# Altium schematic sheet UM.SchDoc: Устройство модуляции
size 594 x 420 mm
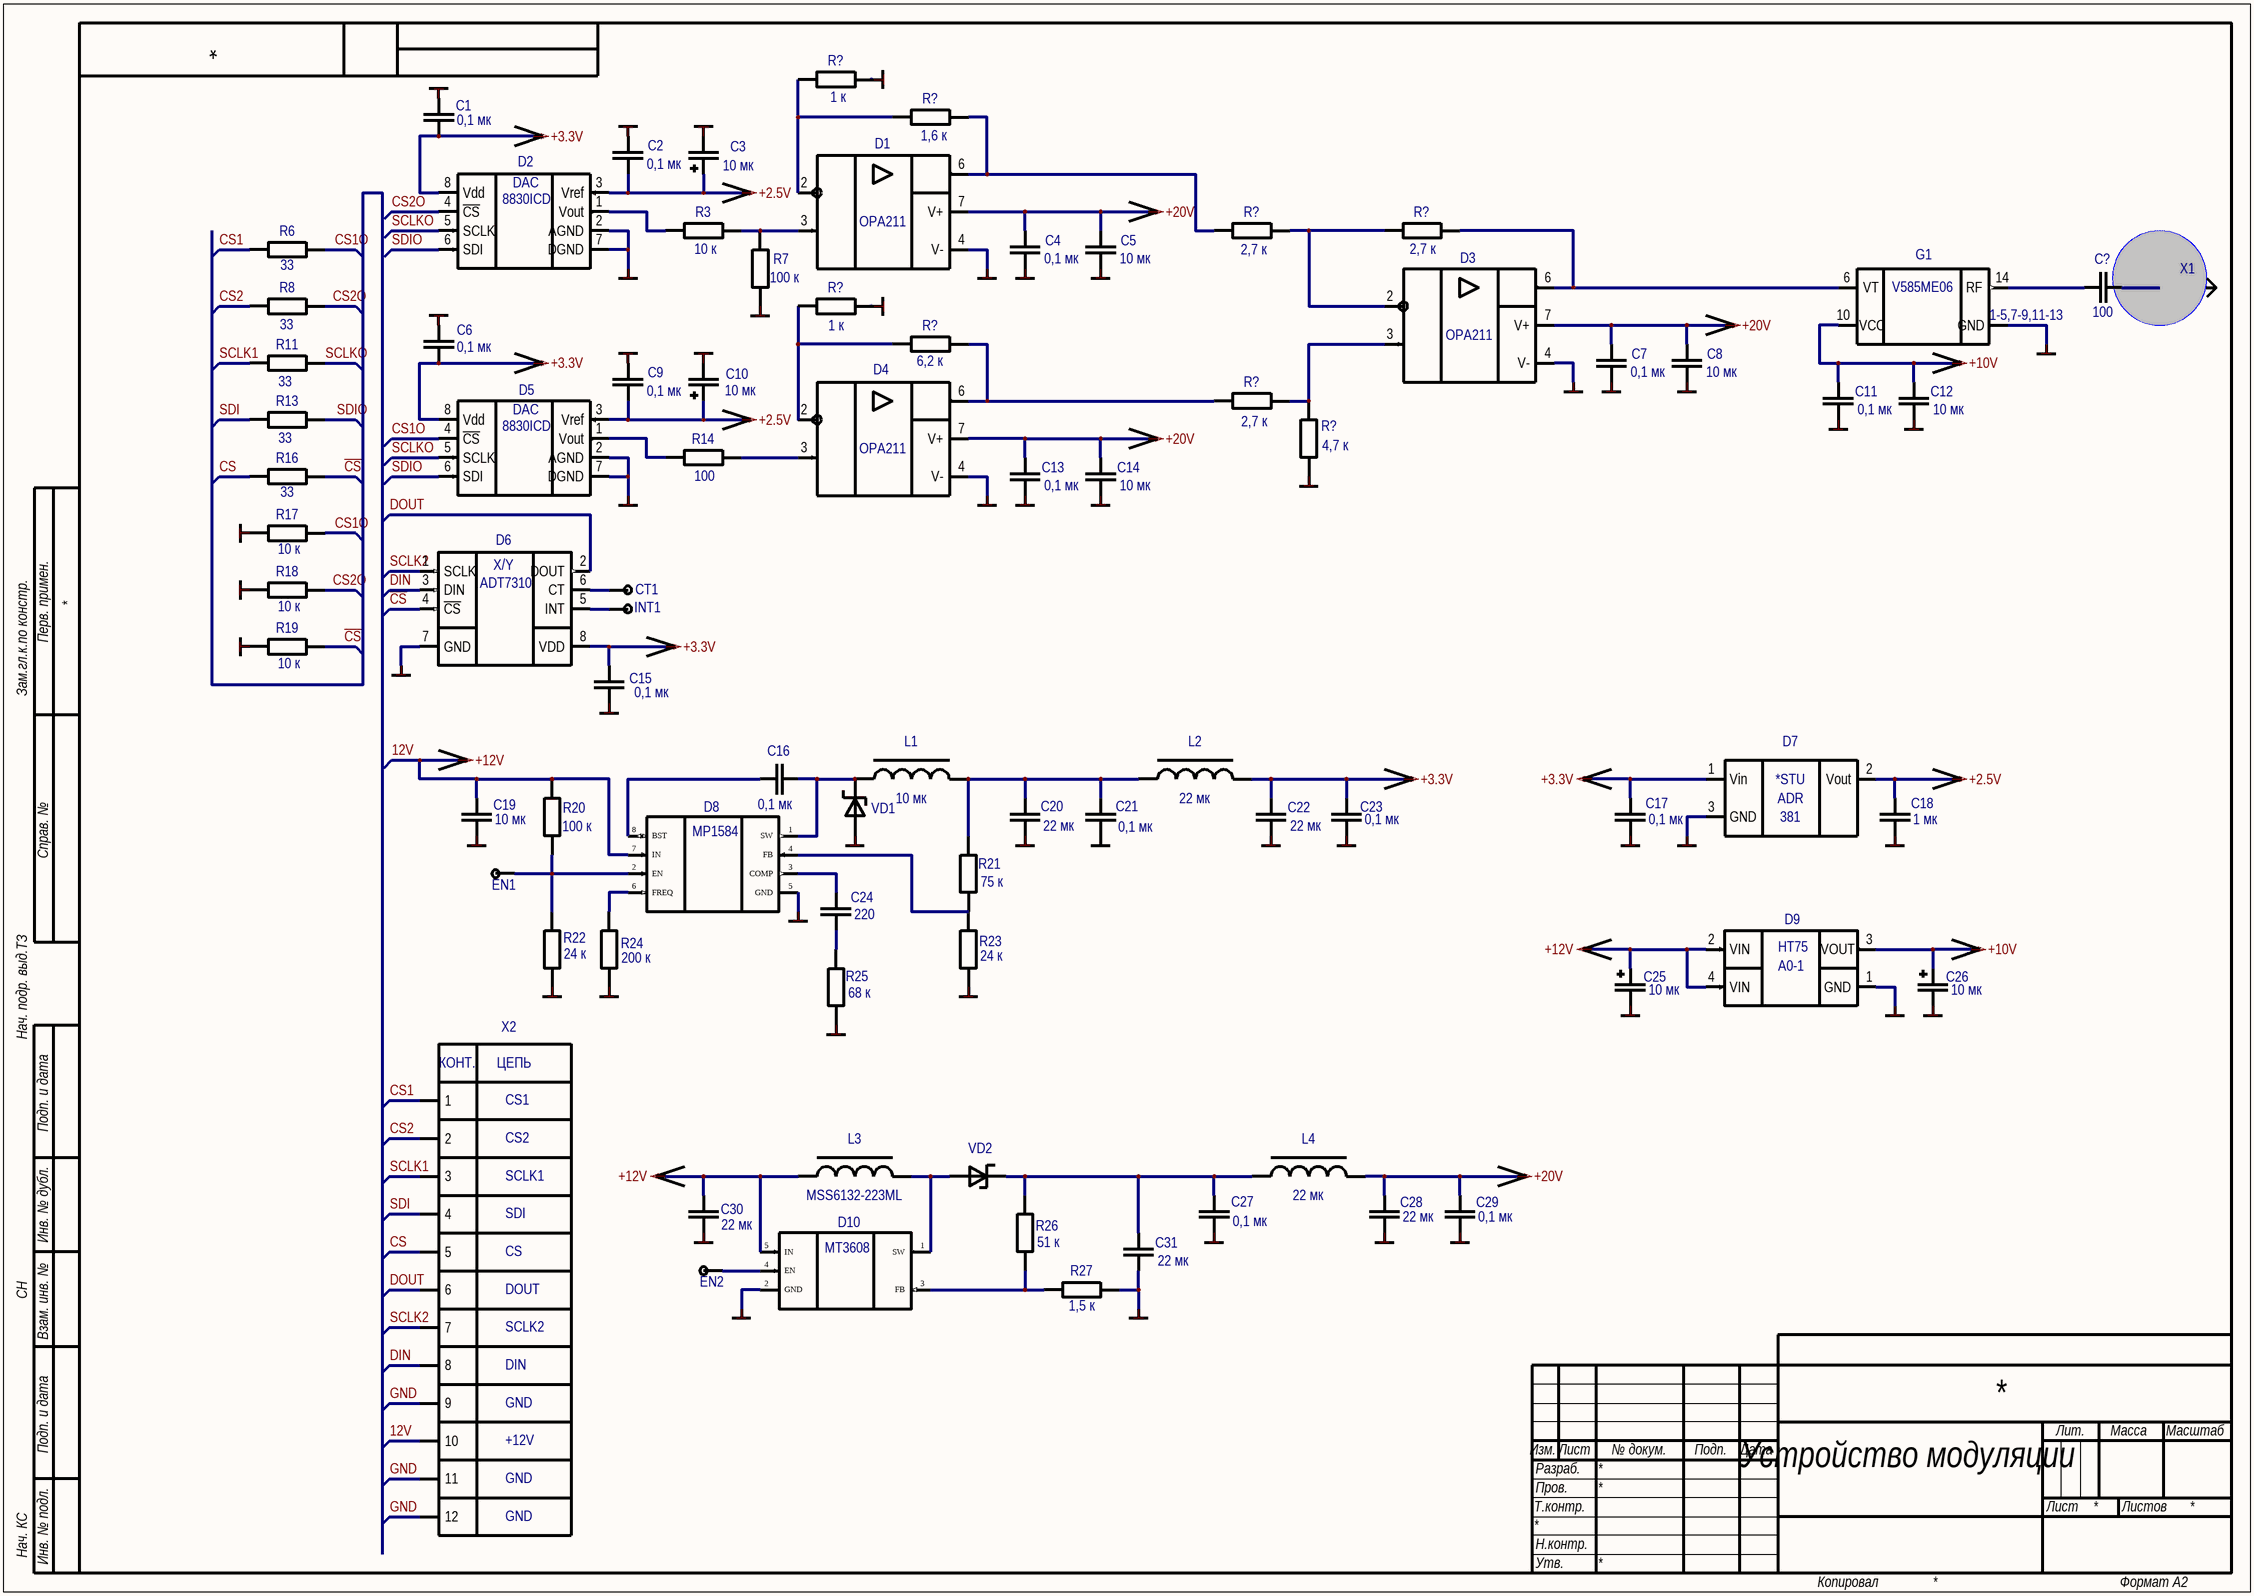
[diagram p0: UM.SchDoc]

## Parts
(Parts that share a designator on the sheet are numbered #1, #2 ... from top to bottom, then left to right.)
*?#1  GND  (value not drawn)  (graphical)
*?#2  VCC  (value not drawn)  (graphical)
*?#3  GND  (value not drawn)  (graphical)
*?#4  GND  (value not drawn)  (graphical)
*?#5  VCC  (value not drawn)  (graphical)
*?#6  VCC  (value not drawn)  (graphical)
*?#7  GND  (value not drawn)  (graphical)
*?#8  GND  (value not drawn)  (graphical)
*?#9  GND  (value not drawn)  (graphical)
*?#10  GND  (value not drawn)  (graphical)
*?#11  GND  (value not drawn)  (graphical)
*?#12  GND  (value not drawn)  (graphical)
*?#13  VCC  (value not drawn)  (graphical)
*?#14  GND  (value not drawn)  (graphical)
*?#15  VCC  (value not drawn)  (graphical)
*?#16  GND  (value not drawn)  (graphical)
*?#17  GND  (value not drawn)  (graphical)
*?#18  VCC  (value not drawn)  (graphical)
*?#19  GND  (value not drawn)  (graphical)
*?#20  GND  (value not drawn)  (graphical)
*?#21  GND  (value not drawn)  (graphical)
*?#22  VCC  (value not drawn)  (graphical)
*?#23  GND  (value not drawn)  (graphical)
*?#24  GND  (value not drawn)  (graphical)
*?#25  VCC  (value not drawn)  (graphical)
*?#26  GND  (value not drawn)  (graphical)
*?#27  GND  (value not drawn)  (graphical)
*?#28  GND  (value not drawn)  (graphical)
*?#29  GND  (value not drawn)  (graphical)
*?#30  GND  (value not drawn)  (graphical)
*?#31  GND  (value not drawn)  (graphical)
*?#32  GND  (value not drawn)  (graphical)
*?#33  GND  (value not drawn)  (graphical)
*?#34  VCC  (value not drawn)  (graphical)
*?#35  GND  (value not drawn)  (graphical)
*?#36  GND  (value not drawn)  (graphical)
*?#37  VCC  (value not drawn)  (graphical)
*?#38  VCC  (value not drawn)  (graphical)
*?#39  VCC  (value not drawn)  (graphical)
*?#40  VCC  (value not drawn)  (graphical)
*?#41  GND  (value not drawn)  (graphical)
*?#42  GND  (value not drawn)  (graphical)
*?#43  GND  (value not drawn)  (graphical)
*?#44  GND  (value not drawn)  (graphical)
*?#45  GND  (value not drawn)  (graphical)
*?#46  GND  (value not drawn)  (graphical)
*?#47  GND  (value not drawn)  (graphical)
*?#48  GND  (value not drawn)  (graphical)
*?#49  GND  (value not drawn)  (graphical)
*?#50  GND  (value not drawn)  (graphical)
*?#51  VCC  (value not drawn)  (graphical)
*?#52  VCC  (value not drawn)  (graphical)
*?#53  GND  (value not drawn)  (graphical)
*?#54  GND  (value not drawn)  (graphical)
*?#55  GND  (value not drawn)  (graphical)
*?#56  GND  (value not drawn)  (graphical)
*?#57  GND  (value not drawn)  (graphical)
*?#58  GND  (value not drawn)  (graphical)
*?#59  GND  (value not drawn)  (graphical)
*?#60  VCC  (value not drawn)  (graphical)
*?#61  VCC  (value not drawn)  (graphical)
*?#62  GND  (value not drawn)  (graphical)
*?#63  GND  (value not drawn)  (graphical)
*?#64  GND  (value not drawn)  (graphical)
*?#65  GND  (value not drawn)  (graphical)
*?#66  GND  (value not drawn)  (graphical)
*?#67  GND  (value not drawn)  (graphical)
C1  0,1 мк  [CAPC1608L]
C2  0,1 мк  [CAPC1608L]
C3  10 мк  [TC3528-1411]
C4  0,1 мк  [CAPC1608L]
C5  10 мк  [CAPC1608L]
C6  0,1 мк  [CAPC1608L]
C7  0,1 мк  [CAPC1608L]
C8  10 мк  [CAPC1608L]
C9  0,1 мк  [CAPC1608L]
C10  10 мк  [TC3528-1411]
C11  0,1 мк  [CAPC1608L]
C12  10 мк  [CAPC1608L]
C13  0,1 мк  [CAPC1608L]
C14  10 мк  [CAPC1608L]
C15  0,1 мк  [CAPC1608L]
C16  0,1 мк  [CAPC1608L]
C17  0,1 мк  [CAPC1608L]
C18  1 мк  [CAPC3216L]
C19  10 мк  [CAPC3216L]
C20  22 мк  [CAPC2012L]
C21  0,1 мк  [CAPC1608L]
C22  22 мк  [CAPC2012L]
C23  0,1 мк  [CAPC1608L]
C24  220  [CAPC1608L]
C25  10 мк  [TC3216-1206]
C26  10 мк  [TC3216-1206]
C27  0,1 мк  [CAPC1608L]
C28  22 мк  [CAPC2012L]
C29  0,1 мк  [CAPC1608L]
C30  22 мк  [CAPC2012L]
C31  22 мк  [CAPC2012L]
C?  100  [CAPC1608L]
CT1  TP  [TP1]  (value not drawn)  (no BOM)
D1  OPA2211  [SOIC127P600-8M]  (value not drawn)
D2  DAC8830  [SO8]  (value not drawn)
D3  OPA2211  [SOIC127P600-8M]  (value not drawn)
D4  OPA2211  [SOIC127P600-8M]  (value not drawn)
D5  DAC8830  [SO8]  (value not drawn)
D6  ADT7310TRZ  [SOIC127P600-8M]  (value not drawn)
D7  AD381  [SOT23-3L]  (value not drawn)
D8  MP3608  [SOIC127P600-9M]  (value not drawn)
D9  (no value)  [SOT89]
D10  MT3608  [SOT23-6]  (value not drawn)
EN1  TP  [TP1]  (value not drawn)  (no BOM)
EN2  TP  [TP1]  (value not drawn)  (no BOM)
G1  V585ME06  [V585ME06]  (value not drawn)
GND?#1  *  (graphical)
GND?#2  *  (graphical)
INT1  TP  [TP1]  (value not drawn)  (no BOM)
L1  10 мк  [INDP5151X31N]
L2  22 мк  [INDP5151X31N]
L3  MSS6132-223ML  [MSS6132]
L4  22 мк  [INDP5151X31N]
R3  10 к  [RESC1608L]
R6  33  [RESC1608L]
R7  100 к  [RESC1608L]
R8  33  [RESC1608L]
R11  33  [RESC1608L]
R13  33  [RESC1608L]
R14  100  [RESC1608L]
R16  33  [RESC1608L]
R17  10 к  [RESC1608L]
R18  10 к  [RESC1608L]
R19  10 к  [RESC1608L]
R20  100 к  [RESC1608L]
R21  75 к  [RESC1005L]
R22  24 к  [RESC1608L]
R23  24 к  [RESC1608L]
R24  200 к  [RESC1608L]
R25  68 к  [RESC1608L]
R26  51 к  [RESC1608L]
R27  1,5 к  [RESC1608L]
R?#1  1 к  [RESC1608L]
R?#2  1,6 к  [RESC1608L]
R?#3  2,7 к  [RESC2012L]
R?#4  2,7 к  [RESC2012L]
R?#5  1 к  [RESC1608L]
R?#6  6,2 к  [RESC1608L]
R?#7  2,7 к  [RESC2012L]
R?#8  4,7 к  [RESC1608L]
VD1  SK56  [DO-214AA]  (value not drawn)
VD2  SK56  [DO-214AA]  (value not drawn)
X1  U.FL-R-SMT(01)  [U.FL-R-SMT]  (value not drawn)
X2  PLD12  [PLD-12]  (value not drawn)

## Nets
12V: C19.2 C25.2 C30.2 D8.7(IN) D9.2(VIN) D9.4(VIN) D10.5(IN) L3.1 R20.2 X2.10  [also labelled +12V]
+2.5V: C2.1 C3.2 C9.1 C10.2 C18.2 D2.3(Vref) D5.3(Vref) D7.2(Vout)
+3.3V: C1.1 C6.1 C15.2 C17.2 C22.2 C23.2 D2.8(Vdd) D5.8(Vdd) D6.8(VDD) D7.1(Vin) L2.2
+10V: C11.2 C12.2 C26.2 D9.3(VOUT) G1.10(VCC)
+20V: C4.2 C5.2 C7.2 C8.2 C13.2 C14.2 C28.2 C29.2 D1.7(V+) D3.7(V+) D4.7(V+) L4.2
GND: C1.2 C2.2 C3.1 C4.1 C5.1 C6.2 C7.1 C8.1 C9.2 C10.1 C11.1 C12.1 C13.1 C14.1 C15.1 C17.1 C18.1 C19.1 C20.1 C22.1 C23.1 C25.1 C26.1 C27.1 C28.1 C29.1 C30.1 C31.1 D1.4(V-) D2.2(AGND) D2.7(DGND) D3.4(V-) D4.4(V-) D5.2(AGND) D5.7(DGND) D6.7(GND) D7.3(GND) D8.5(GND) D8.EPAD D9.1(GND) D10.2(GND) G1.1(GND) G1.2(GND) G1.3(GND) G1.4(GND) G1.5(GND) G1.7(GND) G1.8(GND) G1.9(GND) G1.11(GND) G1.12(GND) G1.13(GND) G1.EPAD R7.1 R17.1 R18.1 R19.1 R22.1 R23.1 R24.1 R25.1 R27.2 R?#1.2 R?#5.2 R?#8.1 VD1.2(Anode) X1.2 X2.9 X2.11 X2.12
~{CS}: D6.4(~{CS}) R16.2 R19.2
CS: R16.1 X2.5
CS1: R6.1 X2.1
CS1O: D5.4(~{CS}) R6.2 R17.2
CS2: R8.1 X2.2
CS2O: D2.4(~{CS}) R8.2 R18.2
DIN: D6.3(DIN) X2.8
DOUT: D6.2(DOUT) X2.6
SCLK1: R11.1 X2.3
SCLK2: D6.1(SCLK) X2.7
SCLKO: D2.5(SCLK) D5.5(SCLK) R11.2
SDI: R13.1 X2.4
SDIO: D2.6(SDI) D5.6(SDI) R13.2
NetC16_1: C16.1 D8.8(BST)
NetC16_2: C16.2 D8.1(SW) L1.1 VD1.1(Cathode)
NetC20_2: C20.2 C21.2 L1.2 L2.1 R21.2
NetC24_1: C24.1 R25.2
NetC24_2: C24.2 D8.3(COMP)
NetC27_2: C27.2 C31.2 L4.1 R26.2 VD2.1(Cathode)
NetC?_1: C?.1 G1.14(RF)
NetC?_2: C?.2 X1.1
NetCT1_1: CT1.1 D6.6(CT)
NetD1_2: D1.2(IN-) R?#1.1 R?#2.1
NetD1_3: D1.3(IN+) R3.2 R7.2
NetD1_6: D1.6(OUT) R?#2.2 R?#3.1
NetD2_1: D2.1(Vout) R3.1
NetD3_2: D3.2(IN-) R?#3.2 R?#4.1
NetD3_3: D3.3(IN+) R?#7.2 R?#8.2
NetD3_6: D3.6(OUT) G1.6(VT) R?#4.2
NetD4_2: D4.2(IN-) R?#5.1 R?#6.1
NetD4_3: D4.3(IN+) R14.2
NetD4_6: D4.6(OUT) R?#6.2 R?#7.1
NetD5_1: D5.1(Vout) R14.1
NetD6_5: D6.5(INT) INT1.1
NetD8_2: D8.2(EN) EN1.1 R20.1 R22.2
NetD8_4: D8.4(FB) R21.1 R23.2
NetD8_6: D8.6(FREQ) R24.2
NetD10_1: D10.1(SW) L3.2 VD2.2(Anode)
NetD10_3: D10.3(FB) R26.1 R27.1
NetD10_4: D10.4(EN) EN2.1

Not connected (* = marked no-connect by the designer): C21 1; D10 6(NC)

## Notes on the sheet
- CS1
- CS2
- SCLK1
- SDI
- CS
- DOUT
- SCLK2
- DIN
- GND
- +12V
- Перв. примен.
- Зам.гл.к.по констр.
- Справ. №
- Нач. подр. выд.ТЗ
- Подп. и дата
- Инв. № дубл.
- СН
- Взам. инв. №
- Изм.
- Лист
- № докум.
- Подп.
- Дата
- Лит.
- Масса
- Масштаб
- Т.контр.
- Пров.
- Разраб.
- Листов
- Нач. КС
- Инв. № подл.
- Н.контр.
- Утв.
- Копировал
- Формат А2
- (in symbol AD381) *STU; ADR; 381
- (in symbol ADT7310) X/Y
- (in symbol DAC8830) DAC; 8830ICD
- (in symbol HT75A0-1) HT75; A0-1
- (in symbol MP3608) MP1584
- (in symbol PLD12) КОНТ.; ЦЕПЬ
- (in symbol V585ME06) 1-5,7-9,11-13

## Library data of the parts
*?#1 *?#3 *?#4 *?#7-*?#12 *?#14 *?#16 *?#17 *?#19-*?#21 *?#23 *?#24 *?#26-*?#33 *?#35 *?#36 *?#41-*?#50 *?#53-*?#59 *?#62-*?#67 = GND: Корпус ЕСКД. Для "наложения" на штатный Power Bar
*?#2 *?#5 *?#6 *?#13 *?#15 *?#18 *?#22 *?#25 *?#34 *?#37-*?#40 *?#51 *?#52 *?#60 *?#61 = VCC: Порт ЕСКД. Для "наложения" на штатный Power Bar
C1 C2 C4 C6 C7 C9 C11 C13 C15-C17 C21 C23 C27 C29 = i6124B5A08701E000001: Чип-конденсатор; ManufacturerPartNumber: 0603 X7R 0,1 мкФ ±10 % 50 В; Name: 0603; Power/Voltage: 50 В; TKE/TKC: {TKE/TKC}; Tolerance: ±10 %; PCADSymbol: C; PCADLibrary: PASSIV.LIB; BCPId: *; Manufacturer: *; Type: Конденсатор; Value: 0,1 мк; ImKey: i6124B5A08701E000001; PCADType: C0603; PCADPattern: C0603
C3 C10 = i6124B5A087030000003: Танталовый конденсатор; ManufacturerPartNumber: К53-67-16 В-10 мкФ ±10 %; Power/Voltage: 16 В; Tolerance: ±10 %; PCADSymbol: TAJ; PCADLibrary: PASSIV.LIB; TU/GOST: АЖЯР.673546.006 ТУ; BCPId: *; Manufacturer: *; Name: TAJB; TKE/TKC: *; Type: Конденсатор; Value: 10 мк; ImKey: i6124B5A087030000003; PCADType: TAJB; PCADPattern: TAJB
C5 C8 C12 C14 = i6124B5A087635000001: Чип-конденсатор; ManufacturerPartNumber: 0603 X5R 10 мкФ ±10 % 25 В; Name: 0603; Power/Voltage: 25 В; TKE/TKC: {TKE/TKC}; Tolerance: ±10 %; PCADSymbol: C; PCADLibrary: PASSIV.LIB; BCPId: *; Manufacturer: *; Type: Конденсатор; Value: 10 мк; ImKey: i6124B5A087635000001; PCADType: C0603; PCADPattern: C0603
C18 = i6124B5A087045000006: Чип-конденсатор; ManufacturerPartNumber: 1206 X7R 1 мкФ ±5 % 16 В; Name: 1206; Power/Voltage: 16 В; TKE/TKC: {TKE/TKC}; Tolerance: ±5 %; PCADSymbol: C; PCADLibrary: PASSIV.LIB; BCPId: *; Manufacturer: *; Type: Конденсатор; Value: 1 мк; ImKey: i6124B5A087045000006; PCADType: C1206; PCADPattern: C1206
C19 = i6124B5A0871F4000004: Чип-конденсатор; ManufacturerPartNumber: 1206 X5R 10 мкФ ±10 % 50 В; Name: 1206; Power/Voltage: 50 В; TKE/TKC: {TKE/TKC}; Tolerance: ±10 %; PCADSymbol: C; PCADLibrary: PASSIV.LIB; BCPId: *; Manufacturer: *; Type: Конденсатор; Value: 10 мк; ImKey: i6124B5A0871F4000004; PCADType: C1206; PCADPattern: C1206
C20 C22 C28 C30 C31 = i6124B5A08704300000C: Чип-конденсатор; ManufacturerPartNumber: 0805 X5R 22 мкФ ±10 % 16 В; Name: 0805; Power/Voltage: 16 В; TKE/TKC: {TKE/TKC}; Tolerance: ±10 %; PCADSymbol: C; PCADLibrary: PASSIV.LIB; BCPId: *; Manufacturer: *; Type: Конденсатор; Value: 22 мк; ImKey: i6124B5A08704300000C; PCADType: C0805; PCADPattern: C0805
C24 = i6124B5A08701A00001B: Чип-конденсатор; ManufacturerPartNumber: 0603 NP0 220 пФ ±5 % 50 В; Name: 0603; Power/Voltage: 50 В; TKE/TKC: {TKE/TKC}; Tolerance: ±5 %; PCADSymbol: C; PCADLibrary: PASSIV.LIB; BCPId: *; Manufacturer: *; Type: Конденсатор; Value: 220; ImKey: i6124B5A08701A00001B; PCADType: C0603; PCADPattern: C0603
C25 C26 = i6124B5A087028000006: Танталовый конденсатор; ManufacturerPartNumber: TAJA106M016RNJ (10 мкФ ±20 % 16 В); Power/Voltage: 16 В; Tolerance: ±20 %; PCADSymbol: TAJ; PCADLibrary: PASSIV.LIB; BCPId: *; Manufacturer: *; Name: TAJA; TKE/TKC: *; Type: Конденсатор; Value: 10 мк; ImKey: i6124B5A087028000006; PCADType: TAJA; PCADPattern: TAJA
C? = i6124B5A08701A000014: Чип-конденсатор; ManufacturerPartNumber: 0603 NP0 100 пФ ±5 % 50 В; Name: 0603; Power/Voltage: 50 В; TKE/TKC: {TKE/TKC}; Tolerance: ±5 %; PCADSymbol: C; PCADLibrary: PASSIV.LIB; BCPId: *; Manufacturer: *; Type: Конденсатор; Value: 100; ImKey: i6124B5A08701A000014; PCADType: C0603; PCADPattern: C0603
CT1 EN1 EN2 INT1 = TP: Test point
D1 D3 D4 = OPA211: Type: Микросхема; BCPId: *; Name: *; Package: R-8; ManufacturerPartNumber: OPA2211
D2 D5 = DAC8830: Manufacturer: Texas Instruments; Type: Микросхема; BCPId: *; ManufacturerPartNumber: DAC8830; TU/GOST: *
D6 = ADT7310: ±0.5°C Accurate, 16-Bit  Digital SPI Temperature Sensor; Manufacturer: Analog Devices, Inc.; Type: Микросхема; BCPId: *; Name: *; Package: SOIC-8 (R-8); ManufacturerPartNumber: ADT7310TRZ
D7 = AD381: Manufacturer: Analog Devices; Type: Микросхема; BCPId: *; Name: *; Package: SOT-23-3; ManufacturerPartNumber: AD381
D8 = MP3608: Manufacturer: MPS; Type: микросхема; ManufacturerPartNumber: MP3608; Name: *
D9 = HT75A0-1: IN-12V, OUT-10V; Type: Микросхема; BCPId: *; Name: *; Package: SOT89
D10 = MT3608: Manufacturer: AEROSEMI; Type: микросхема; ManufacturerPartNumber: MT3608; Name: *; Package: SOT23-6
GND?#1 GND?#2 = GND: Корпус ЕСКД. Для "наложения" на штатный Power Bar; Designator: *?
L1 = i6124B5A08718C00000C: Дроссель; Manufacturer: Coilcraft; ManufacturerPartNumber: MSS5131-103ML (10 мкГн ±20 % 0,98 А); Tolerance: ±20 %; PCADSymbol: INDUCT; PCADLibrary: PASSIV.LIB; BCPId: *; Name: *; Package: MSS5131; Type: Дроссель; Value: 10 мк; ImKey: i6124B5A08718C00000C; PCADType: MSS5131; PCADPattern: MSS5131
L2 L4 = i6124B5A0876B3000008: Дроссель; Manufacturer: Coilcraft; ManufacturerPartNumber: MSS5131-223ML* Coilcraft; Tolerance: ±20 %; PCADSymbol: INDUCT; PCADLibrary: PASSIV.LIB; BCPId: *; Name: *; Package: MSS5131; Type: Дроссель; Value: 22 мк; ImKey: i6124B5A0876B3000008; PCADType: MSS5131; PCADPattern: MSS5131
L3 = MSS6132: Дроссель; Manufacturer: Coilcraft; ManufacturerPartNumber: MSS6132-***MLB; Value: {Value}; Tolerance: {Tolerance}; BCPId: *; Name: *; Package: MSS6132; Type: Дроссель
R3 R17-R19 = i6124B5A08707A000001: Чип-резистор; ManufacturerPartNumber: Р1-12-0,1-10 кОм ±5 % - Т; Name: 0603; Tolerance: ±5 %; Power/Voltage: 0,1 Вт; TU/GOST: АЛЯР.434110.005 ТУ; BCPId: *; Manufacturer: *; Type: Резистор; Value: 10 к; ImKey: i6124B5A08707A000001
R6 R8 R11 R13 R16 = i6124B5A08707A000013: Чип-резистор; ManufacturerPartNumber: Р1-12-0,1-33 Ом ±5 % - Т; Name: 0603; Tolerance: ±5 %; Power/Voltage: 0,1 Вт; TU/GOST: АЛЯР.434110.005 ТУ; BCPId: *; Manufacturer: *; Type: Резистор; Value: 33; ImKey: i6124B5A08707A000013
R7 R20 = i6124B5A08707A000017: Чип-резистор; ManufacturerPartNumber: Р1-12-0,1-100 кОм ±5 % - Т; Name: 0603; Tolerance: ±5 %; Power/Voltage: 0,1 Вт; TU/GOST: АЛЯР.434110.005 ТУ; BCPId: *; Manufacturer: *; Type: Резистор; Value: 100 к; ImKey: i6124B5A08707A000017
R14 = i6124B5A08707A000021: Чип-резистор; ManufacturerPartNumber: Р1-12-0,1-100 Ом ±5 % - Т; Name: 0603; Tolerance: ±5 %; Power/Voltage: 0,1 Вт; TU/GOST: АЛЯР.434110.005 ТУ; BCPId: *; Manufacturer: *; Type: Резистор; Value: 100; ImKey: i6124B5A08707A000021
R21 = i6124B5A08765B00001E: Чип-резистор; ManufacturerPartNumber: Р1-12-0,062-75 кОм ±1 % - Т; Name: 0402; Tolerance: ±1 %; Power/Voltage: 0,062 Вт; TU/GOST: АЛЯР.434110.005 ТУ; BCPId: *; Manufacturer: *; Type: Резистор; Value: 75 к; ImKey: i6124B5A08765B00001E
R22 R25 = R0603: Чип-резистор; Name: 0603; Tolerance: ±5 %; BCPId: *; Manufacturer: *; ManufacturerPartNumber: *; Type: Резистор
  R22: Value: 24 к
  R25: Value: 68 к
R23 = i6124B5A08707A00001A: Чип-резистор; ManufacturerPartNumber: Р1-12-0,1-24 кОм ±5 % - Т; Name: 0603; Tolerance: ±5 %; Power/Voltage: 0,1 Вт; TU/GOST: АЛЯР.434110.005 ТУ; BCPId: *; Manufacturer: *; Type: Резистор; Value: 24 к; ImKey: i6124B5A08707A00001A
R24 = i6124B5A08707A000088: Чип-резистор; ManufacturerPartNumber: Р1-12-0,1-200 кОм ±5 % - Т; Name: 0603; Tolerance: ±5 %; Power/Voltage: 0,1 Вт; TU/GOST: АЛЯР.434110.005 ТУ; BCPId: *; Manufacturer: *; Type: Резистор; Value: 200 к; ImKey: i6124B5A08707A000088
R26 = i6124B5A08707A00006A: Чип-резистор; ManufacturerPartNumber: Р1-12-0,1-51 кОм ±5 % - Т; Name: 0603; Tolerance: ±5 %; Power/Voltage: 0,1 Вт; TU/GOST: АЛЯР.434110.005 ТУ; BCPId: *; Manufacturer: *; Type: Резистор; Value: 51 к; ImKey: i6124B5A08707A00006A
R27 = i6124B5A08707A000009: Чип-резистор; ManufacturerPartNumber: Р1-12-0,1-1,5 кОм ±5 % - Т; Name: 0603; Tolerance: ±5 %; Power/Voltage: 0,1 Вт; TU/GOST: АЛЯР.434110.005 ТУ; BCPId: *; Manufacturer: *; Type: Резистор; Value: 1,5 к; ImKey: i6124B5A08707A000009
R?#1 R?#5 = i6124B5A08707A000008: Чип-резистор; ManufacturerPartNumber: Р1-12-0,1-1 кОм ±5 % - Т; Name: 0603; Tolerance: ±5 %; Power/Voltage: 0,1 Вт; TU/GOST: АЛЯР.434110.005 ТУ; BCPId: *; Manufacturer: *; Type: Резистор; Value: 1 к; ImKey: i6124B5A08707A000008
R?#2 = i6124B5A08707A00004D: Чип-резистор; ManufacturerPartNumber: Р1-12-0,1-1,6 кОм ±5 % - Т; Name: 0603; Tolerance: ±5 %; Power/Voltage: 0,1 Вт; TU/GOST: АЛЯР.434110.005 ТУ; BCPId: *; Manufacturer: *; Type: Резистор; Value: 1,6 к; ImKey: i6124B5A08707A00004D
R?#3 R?#4 R?#7 = i6124B5A0870A7000019: Чип-резистор; ManufacturerPartNumber: Р1-12-0,125-2,7 кОм ±5 % - Т; Name: 0805; Tolerance: ±5 %; Power/Voltage: 0,125 Вт; TU/GOST: АЛЯР.434110.005 ТУ; BCPId: *; Manufacturer: *; Type: Резистор; Value: 2,7 к; ImKey: i6124B5A0870A7000019
R?#6 = i6124B5A08707A000038: Чип-резистор; ManufacturerPartNumber: Р1-12-0,1-6,2 кОм ±5 % - Т; Name: 0603; Tolerance: ±5 %; Power/Voltage: 0,1 Вт; TU/GOST: АЛЯР.434110.005 ТУ; BCPId: *; Manufacturer: *; Type: Резистор; Value: 6,2 к; ImKey: i6124B5A08707A000038
R?#8 = i6124B5A08707A00001C: Чип-резистор; ManufacturerPartNumber: Р1-12-0,1-4,7 кОм ±5 % - Т; Name: 0603; Tolerance: ±5 %; Power/Voltage: 0,1 Вт; TU/GOST: АЛЯР.434110.005 ТУ; BCPId: *; Manufacturer: *; Type: Резистор; Value: 4,7 к; ImKey: i6124B5A08707A00001C
VD1 VD2 = SK56: 5 A Schottky barrier rectifier; Type: Диод; ManufacturerPartNumber: SK56
X2 = PLD12: Штыри на плату, шаг 2.54мм., однорядные; BCPId: *; ManufacturerPartNumber: PLD12; Rem: *; Package: *; TU/GOST: *; Type: Вилка; HelpURL: *; Price: *
G1 = V585ME06: BCPId: *; Type: Генератор; ManufacturerPartNumber: V585ME06
X1 = U.FL-R-SMT(01): BCPId: *; Name: *; Type: Вилка